# Altium schematic sheet Buck Converter_AX3116.SchDoc
size A
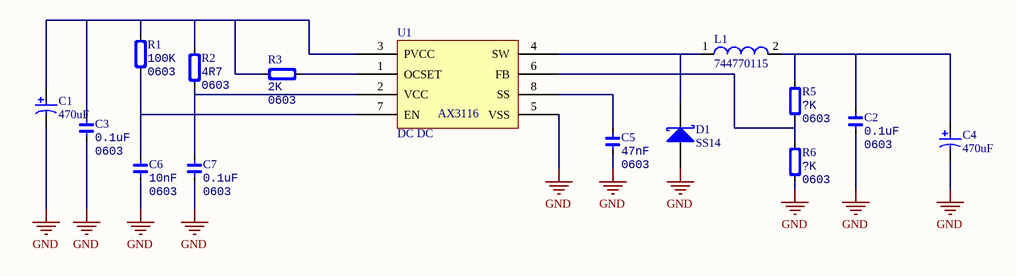
[diagram p0: Buck Converter_AX3116.SchDoc]

## Parts
C1  470uF  [NIC-CAPA2-10X10_V]
C2  value 0.1uF  Type: 0603  [CAP_0603]  (hidden comment: C0603)
C3  value 0.1uF  Type: 0603  [CAP_0603]  (hidden comment: C0603)
C4  470uF  [NIC-CAPA2-10X10_V]
C5  value 47nF  Type: 0603  [CAP_0603]  (hidden comment: C0603)
C6  value 10nF  Type: 0603  [CAP_0603]  (hidden comment: C0603)
C7  value 0.1uF  Type: 0603  [CAP_0603]  (hidden comment: C0603)
D1  SS14  [SMA]
L1  744770115  [WE-PD-XL]
R1  value 100K  Type: 0603  [RES_0603]  (hidden comment: R0603)
R2  value 4R7  Type: 0603  [RES_0603]  (hidden comment: R0603)
R3  value 2K  Type: 0603  [RES_0603]  (hidden comment: R0603)
R5  value ?K  Type: 0603  [RES_0603]  (hidden comment: R0603)
R6  value ?K  Type: 0603  [RES_0603]  (hidden comment: R0603)
U1  DC DC  [SOP-8L-EP]

## Nets
GND: C1.2 C2.1 C3.1 C4.2 C5.1 C6.1 C7.1 D1.A R6.1 U1.5(VSS)
NetC1_1: C1.1 C3.2 R1.2 R2.2 R3.1 U1.3(PVCC)
NetC2_2: C2.2 C4.1 L1.2 R5.2
NetC5_2: C5.2 U1.8(SS)
NetC6_2: C6.2 R1.1 U1.7(EN)
NetC7_2: C7.2 R2.1 U1.2(VCC)
NetD1_K: D1.K L1.1 U1.4(SW)
NetR3_2: R3.2 U1.1(OCSET)
NetR5_1: R5.1 R6.2 U1.6(FB)

## Library data of the parts
C1 C4 = CMP-0687-00002-1: Aluminum Electrolytic Capacitor, UD Series, Low Impedance, 470 uF, 25 V, + / - 20%, -55 to 105 degC, Chip Type, 10 x 10 mm D x L, Pb-Free, Reel; PartNumber: UUD1E471MNL1GS; Manufacturer: Nichicon; Impedance: 0.09 Ohm; Endurance Time: 5000 h; Rated Ripple Current (at 100kHz): 670 mA; Packing: Dia382mm Reel; Rated Voltage: 25 V; Tolerance Rated Capacitance: -20 to 20%; ComponentLink3URL: http://products.nichicon.co.jp/en/pdf/XJA043/e-ud.pdf; ComponentLink2URL: http://products.nichicon.co.jp/en/pdf/XJA043/e-ud.pdf; Length: 10 mm; ComponentLink3Description: Package Specification; PackageReference: CAPAE-D10H10; ComponentLink1URL: http://www.nichicon.co.jp/; DatasheetVersion: 08/2012; Rated Capacitance: 470 uF; ComponentLink1Description: Manufacturer URL; ComponentLink2Description: Datasheet; Diameter: 10 mm; PackageDescription: 2-Pin Surface Mount Device, Diameter 10 mm, Height 10 mm, Pitch 8 mm; RoHS: TRUE; Mounting Technology: Surface Mount
C2 C3 C5-C7 = Cap_0603: Capacitor; Specification: X7R 50V; Manufacturer: *; Supplier 1: Digi-Key
  C2 C3 C7: Supplier Part Number 1: 399-7969-1-ND
  C5: Supplier Part Number 1: 399-7802-6-ND
  C6: Supplier Part Number 1: 478-1227-1-ND
D1 = Diode Schottky: Supplier 1: Digi-Key; Supplier Part Number 1: SS14-E3/5ATGITR-ND
L1 = CMP-0227-00202-1: SMD-Shielded Power Inductor WE-PD, L = 15.0 µH; Inductance: 15.0 ÂµH; PackageDescription: SMD Inductor, 2-Leads, Body 12.0 x 12.0 mm; ComponentLink2Description: Datasheet; PackageReference: WE-PD-XL; ComponentLink1URL: http://www.we-online.com; ComponentLink1Description: Manufacturer Link; DatasheetVersion: ver 5, Oct-2004; PackageVersion: 2004; ComponentLink2URL: http://www.we-online.de/katalog/media/pdf/744770115.pdf
R1-R3 R5 R6 = Res_0603: Resistor; Specification: ±5%; Manufacturer: *
  R1: Supplier 1: Digi-Key; Supplier Part Number 1: 311-100KHRCT-ND
  R2: Supplier 1: Digi-Key; Supplier Part Number 1: 541-4.7JCT-ND
  R3: Supplier 1: Digi-Key; Supplier Part Number 1: P2.0KDBCT-ND
U1 = AX3116